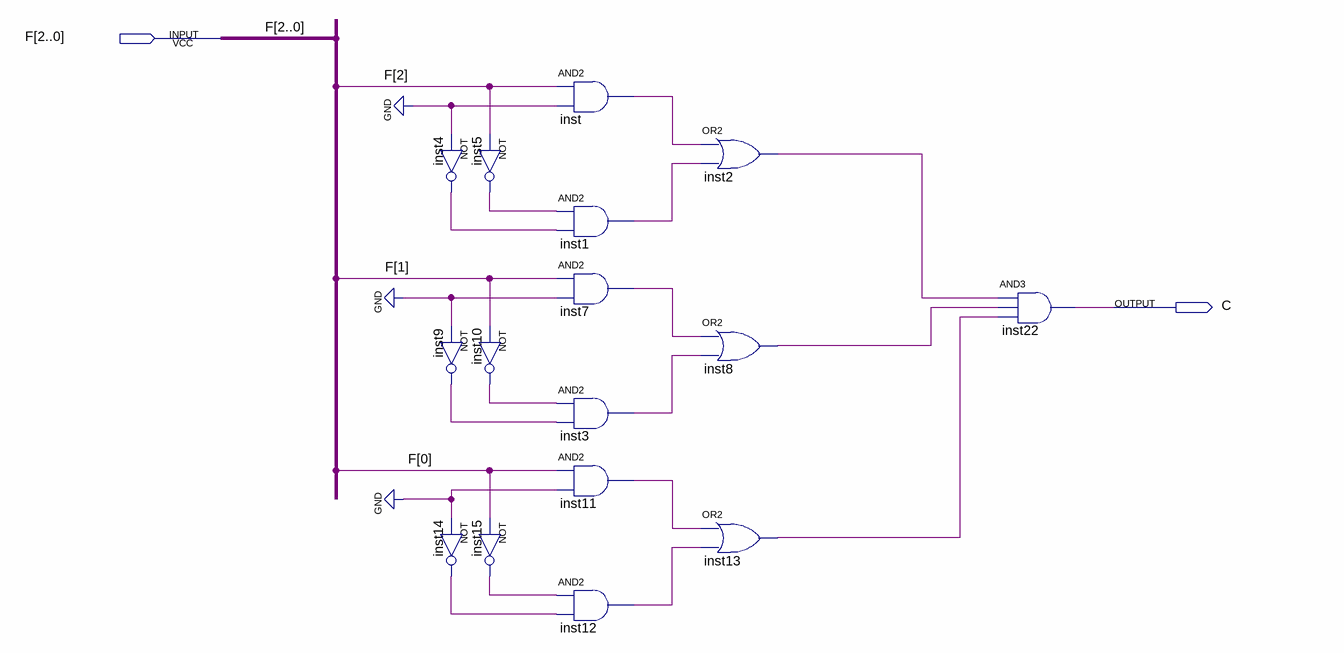
[diagram p0: schematic sheet]
// Quartus schematic CMPZERO.bdf as structural Verilog: 16 symbols, 2 pins
module CMPZERO (
  input  [2:0] F,
  output C
);

  wire inst1_out, inst2_out, inst3_out, inst4_out, inst5_out, inst7_out, inst8_out, inst9_out, inst10_out,
       inst11_out, inst12_out, inst13_out, inst14_out, inst15_out, inst_out;

  not inst4 (inst4_out, 1'b0);
  not inst9 (inst9_out, 1'b0);
  not inst14 (inst14_out, 1'b0);
  not inst5 (inst5_out, F[2]);
  not inst10 (inst10_out, F[1]);
  not inst15 (inst15_out, F[0]);
  and inst (inst_out, F[2], 1'b0);
  and inst1 (inst1_out, inst5_out, inst4_out);
  and inst7 (inst7_out, F[1], 1'b0);
  and inst3 (inst3_out, inst10_out, inst9_out);
  and inst11 (inst11_out, F[0], 1'b0);
  and inst12 (inst12_out, inst15_out, inst14_out);
  or inst2 (inst2_out, inst_out, inst1_out);
  or inst8 (inst8_out, inst7_out, inst3_out);
  or inst13 (inst13_out, inst11_out, inst12_out);
  and inst22 (C, inst2_out, inst8_out, inst13_out);
endmodule
